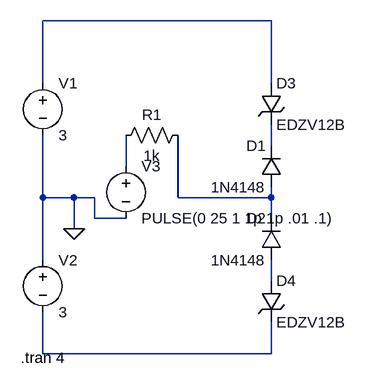
[diagram p0: schematic input-clamps.asc]
input-clamps.asc, the LTspice schematic file:
Version 4
SHEET 1 880 680
WIRE 192 -96 -160 -96
WIRE -160 0 -160 -96
WIRE 192 0 192 -96
WIRE 192 96 192 64
WIRE -32 128 -32 80
WIRE -160 176 -160 80
WIRE -112 176 -160 176
WIRE -80 176 -112 176
WIRE 48 176 48 80
WIRE 192 176 192 160
WIRE 192 176 48 176
WIRE -80 208 -80 176
WIRE -32 208 -80 208
WIRE 192 208 192 176
WIRE -112 224 -112 176
WIRE -160 272 -160 176
WIRE 192 304 192 272
WIRE -160 416 -160 352
WIRE 192 416 192 368
WIRE 192 416 -160 416
FLAG -112 224 0
SYMBOL diode 208 160 R180
WINDOW 0 24 64 Left 2
WINDOW 3 24 0 Left 2
SYMATTR InstName D1
SYMATTR Value 1N4148
SYMBOL diode 208 272 R180
WINDOW 0 24 64 Left 2
WINDOW 3 24 0 Left 2
SYMATTR InstName D2
SYMATTR Value 1N4148
SYMBOL zener 176 0 R0
SYMATTR InstName D3
SYMATTR Value EDZV12B
SYMATTR Description Diode
SYMATTR Type diode
SYMBOL zener 176 304 R0
SYMATTR InstName D4
SYMATTR Value EDZV12B
SYMATTR Description Diode
SYMATTR Type diode
SYMBOL voltage -160 -16 R0
WINDOW 123 0 0 Left 2
WINDOW 39 0 0 Left 2
SYMATTR InstName V1
SYMATTR Value 3
SYMBOL voltage -160 256 R0
WINDOW 123 0 0 Left 2
WINDOW 39 0 0 Left 2
SYMATTR InstName V2
SYMATTR Value 3
SYMBOL voltage -32 112 R0
WINDOW 123 0 0 Left 2
WINDOW 39 0 0 Left 2
SYMATTR InstName V3
SYMATTR Value PULSE(0 25 1 1p 1p .01 .1)
SYMBOL res 64 64 R90
WINDOW 0 0 56 VBottom 2
WINDOW 3 32 56 VTop 2
SYMATTR InstName R1
SYMATTR Value 1k
TEXT -194 422 Left 2 !.tran 4

The netlist it stands for:
* input-clamps.asc
D1 N004 N002 1N4148
D2 N005 N004 1N4148
D3 N001 N002 EDZV12B
D4 N005 N006 EDZV12B
V1 N001 0 3
V2 0 N006 3
V3 N003 0 PULSE(0 25 1 1p 1p .01 .1)
R1 N004 N003 1k
.model D D
.lib standard.dio
.tran 4
.backanno
.end